# Altium schematic sheet LPCB220 - G210X MUX INTERFACE.SchDoc
size A3; Address1: Factory 10; Address2: 9-13 Dingley Avenue, Dandeong, VICTORIA 3175, AUSTRALIA; DocumentNumber: 8; Revision: 1; SheetNumber: 8; SheetTotal: 18; Lockie__PCB_SUB_ASSEMBLY: G210 Multiplexer Interface; Lockie__PCB_ASSEMBLY: Brake Control; Lockie__LDL: LPCB220; Lockie__PCB_DESCRIPTION: Redundant Stepper Node
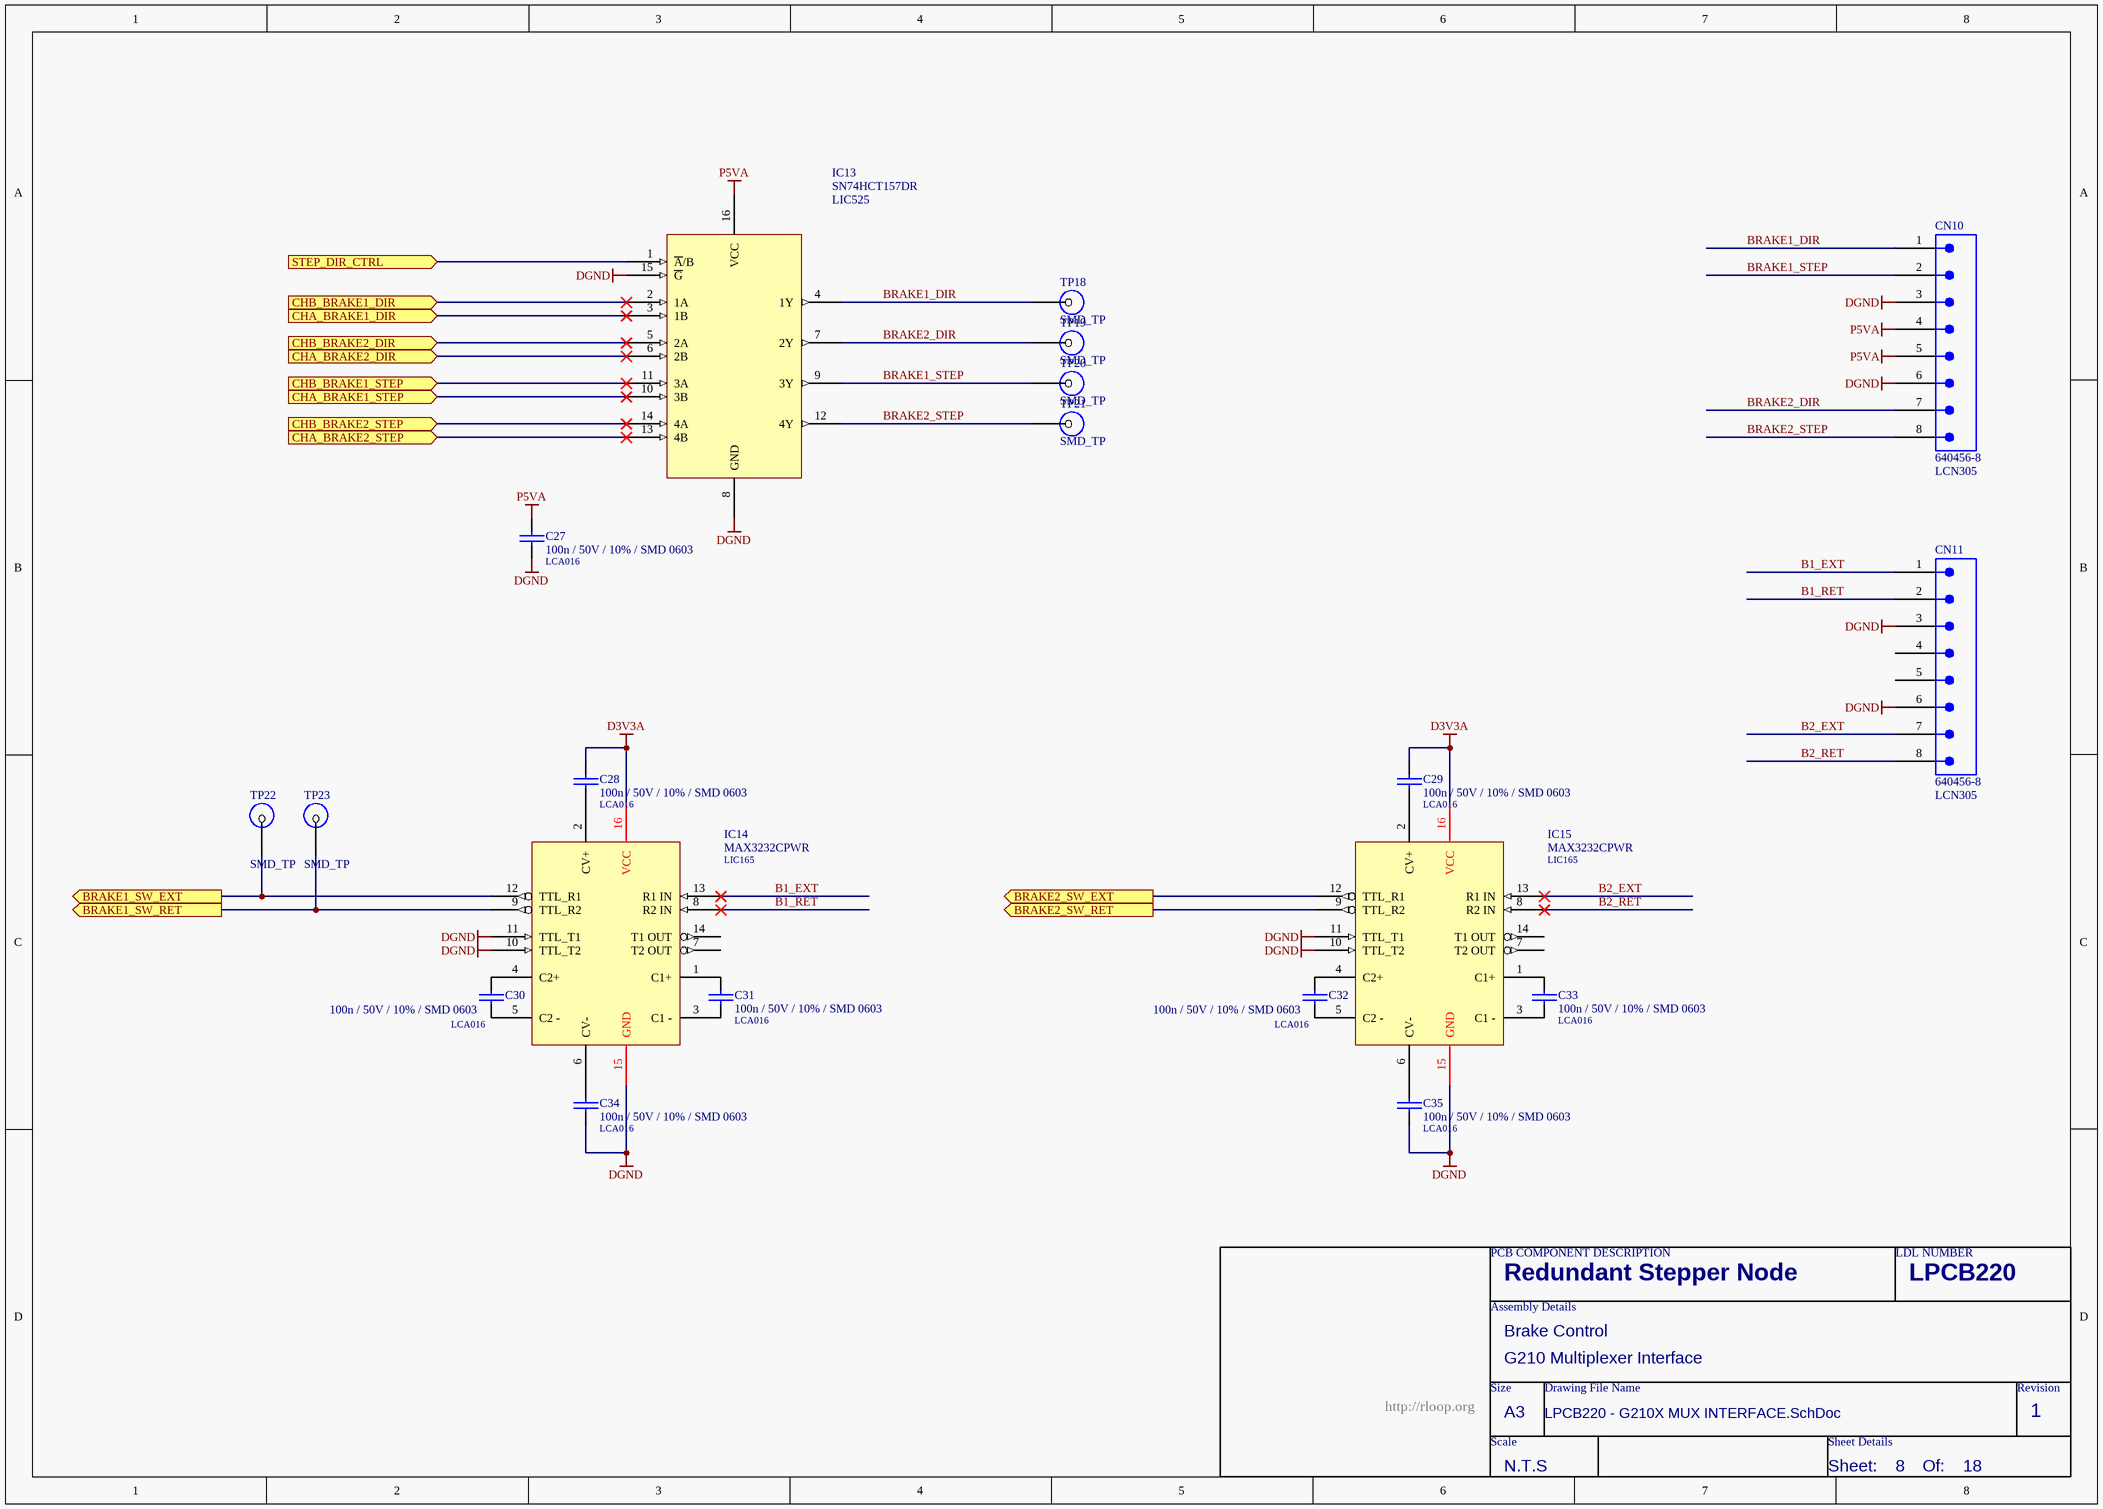
[diagram p0: LPCB220 - G210X MUX INTERFACE.SchDoc]

## Parts
C27  100n / 50V / 10% / SMD 0603  LDL_NUMBER: LCA016  [LFP011__CC1608-0603-IPC7351_B]
C28  100n / 50V / 10% / SMD 0603  LDL_NUMBER: LCA016  [LFP011__CC1608-0603-IPC7351_B]
C29  100n / 50V / 10% / SMD 0603  LDL_NUMBER: LCA016  [LFP011__CC1608-0603-IPC7351_B]
C30  100n / 50V / 10% / SMD 0603  LDL_NUMBER: LCA016  [LFP011__CC1608-0603-IPC7351_B]
C31  100n / 50V / 10% / SMD 0603  LDL_NUMBER: LCA016  [LFP011__CC1608-0603-IPC7351_B]
C32  100n / 50V / 10% / SMD 0603  LDL_NUMBER: LCA016  [LFP011__CC1608-0603-IPC7351_B]
C33  100n / 50V / 10% / SMD 0603  LDL_NUMBER: LCA016  [LFP011__CC1608-0603-IPC7351_B]
C34  100n / 50V / 10% / SMD 0603  LDL_NUMBER: LCA016  [LFP011__CC1608-0603-IPC7351_B]
C35  100n / 50V / 10% / SMD 0603  LDL_NUMBER: LCA016  [LFP011__CC1608-0603-IPC7351_B]
CN10  640456-8  LDL_NUMBER: LCN305  [640456-8]
CN11  640456-8  LDL_NUMBER: LCN305  [640456-8]
IC13  SN74HCT157DR  LDL_NUMBER: LIC525  [LFP079__SOP16]
IC14  MAX3232CPWR  LDL_NUMBER: LIC165  [LFP049__TSSOP-16]
IC15  MAX3232CPWR  LDL_NUMBER: LIC165  [LFP049__TSSOP-16]
TP18  SMD_TP  [SMD-TP]  (no BOM)
TP19  SMD_TP  [SMD-TP]  (no BOM)
TP20  SMD_TP  [SMD-TP]  (no BOM)
TP21  SMD_TP  [SMD-TP]  (no BOM)
TP22  SMD_TP  [SMD-TP]  (no BOM)
TP23  SMD_TP  [SMD-TP]  (no BOM)

## Ports
BRAKE1_SW_EXT (out), BRAKE1_SW_RET (out), BRAKE2_SW_EXT (out), BRAKE2_SW_RET (out), CHA_BRAKE1_DIR (in), CHA_BRAKE1_STEP (in), CHA_BRAKE2_DIR (in), CHA_BRAKE2_STEP (in), CHB_BRAKE1_DIR (in), CHB_BRAKE1_STEP (in), CHB_BRAKE2_DIR (in), CHB_BRAKE2_STEP (in), STEP_DIR_CTRL (in)

## Nets
D3V3A: C28.1 C29.1 IC14.16(VCC) IC15.16(VCC)
DGND: C27.2 C34.2 C35.2 CN10.3 CN10.6 CN11.3 CN11.6 IC13.8(GND) IC13.15(~{G}) IC14.10(TTL_T2) IC14.11(TTL_T1) IC14.15(GND) IC15.10(TTL_T2) IC15.11(TTL_T1) IC15.15(GND)
P5VA: C27.1 CN10.4 CN10.5 IC13.16(VCC)
B1_EXT: CN11.1 IC14.13(R1_IN)
B1_RET: CN11.2 IC14.8(R2_IN)
B2_EXT: CN11.7 IC15.13(R1_IN)
B2_RET: CN11.8 IC15.8(R2_IN)
BRAKE1_DIR: CN10.1 IC13.4(1Y) TP18.1
BRAKE1_STEP: CN10.2 IC13.9(3Y) TP20.1
BRAKE1_SW_EXT: IC14.12(TTL_R1) TP22.1 ; port BRAKE1_SW_EXT
BRAKE1_SW_RET: IC14.9(TTL_R2) TP23.1 ; port BRAKE1_SW_RET
BRAKE2_DIR: CN10.7 IC13.7(2Y) TP19.1
BRAKE2_STEP: CN10.8 IC13.12(4Y) TP21.1
BRAKE2_SW_EXT: IC15.12(TTL_R1) ; port BRAKE2_SW_EXT
BRAKE2_SW_RET: IC15.9(TTL_R2) ; port BRAKE2_SW_RET
CHA_BRAKE1_DIR: IC13.3(1B) ; port CHA_BRAKE1_DIR
CHA_BRAKE1_STEP: IC13.10(3B) ; port CHA_BRAKE1_STEP
CHA_BRAKE2_DIR: IC13.6(2B) ; port CHA_BRAKE2_DIR
CHA_BRAKE2_STEP: IC13.13(4B) ; port CHA_BRAKE2_STEP
CHB_BRAKE1_DIR: IC13.2(1A) ; port CHB_BRAKE1_DIR
CHB_BRAKE1_STEP: IC13.11(3A) ; port CHB_BRAKE1_STEP
CHB_BRAKE2_DIR: IC13.5(2A) ; port CHB_BRAKE2_DIR
CHB_BRAKE2_STEP: IC13.14(4A) ; port CHB_BRAKE2_STEP
STEP_DIR_CTRL: IC13.1(~{A}/B) ; port STEP_DIR_CTRL
NetC28_2: C28.2 IC14.2(CV+)
NetC29_2: C29.2 IC15.2(CV+)
NetC30_1: C30.1 IC14.4(C2+)
NetC30_2: C30.2 IC14.5(C2_-)
NetC31_1: C31.1 IC14.1(C1+)
NetC31_2: C31.2 IC14.3(C1_-)
NetC32_1: C32.1 IC15.4(C2+)
NetC32_2: C32.2 IC15.5(C2_-)
NetC33_1: C33.1 IC15.1(C1+)
NetC33_2: C33.2 IC15.3(C1_-)
NetC34_1: C34.1 IC14.6(CV-)
NetC35_1: C35.1 IC15.6(CV-)

Not connected (* = marked no-connect by the designer): CN11 4 5; IC14 7(T2_OUT) 14(T1_OUT); IC15 7(T2_OUT) 14(T1_OUT)

## Notes on the sheet
- PCB COMPONENT DESCRIPTION
- LDL NUMBER
- Assembly Details
- Size
- Drawing File Name
- Revision
- http://rloop.org
- Scale
- A3
- Sheet Details
- N.T.S
- Sheet:
- Of:

## Library data of the parts
C27 = 100n / 50V / 10% / SMD 0603: Capacitor, Ceramic Chip, 100nF (0.1uF), 50V, 5%, SMD 0603 [LCA016]; FMEDA__OPERATING__VOLTAGE_MIN: 0; FMEDA__OPERATING__VOLTAGE_MAX: 3.3; FMEDA__OPERATING__TEMP_MIN: -20; FMEDA__OPERATING__TEMP_TYP: 27; FMEDA__OPERATING__TEMP_MAX: 50; FMEDA__CHANNEL: COM; Value: 100n; FMEDA__FUNCTION_IN_SYSTEM: *; FMEDA__OPERATING__VOLTAGE_TYP: 3.3
C28-C35 = 100n / 50V / 10% / SMD 0603: Capacitor, Ceramic Chip, 100nF, 50V, 10%, SMD 0603; FMEDA__OPERATING__VOLTAGE_MIN: 0; FMEDA__OPERATING__VOLTAGE_MAX: 3.3; FMEDA__OPERATING__TEMP_MIN: -20; FMEDA__OPERATING__TEMP_TYP: 27; FMEDA__OPERATING__TEMP_MAX: 50; FMEDA__CHANNEL: COM; Value: 100n; FMEDA__FUNCTION_IN_SYSTEM: *; FMEDA__OPERATING__VOLTAGE_TYP: 3.3
CN10 CN11 = 640456-8: Connector, Male Header, 8 Way; FMEDA__CHANNEL: COM; FMEDA__OPERATING__CURRENT_MAX: 0; FMEDA__OPERATING__TEMP_MAX: 50; FMEDA__OPERATING__TEMP_MIN: -20; FMEDA__OPERATING__TEMP_TYP: 27; FMEDA__OPERATING__VOLTAGE_MAX: 16; FMEDA__OPERATING__VOLTAGE_TYP: 12; FMEDA__FUNCTION_IN_SYSTEM: *; FMEDA__OPERATING__CURRENT_MIN: 0; FMEDA__OPERATING__CURRENT_TYP: 0; FMEDA__OPERATING__VOLTAGE_MIN: 0
IC13 = SN74HCT157DR: IC, Multiplexer Select 2-1 [LIC525]; FMEDA__CHANNEL: COM; FMEDA__FUNCTION_IN_SYSTEM: *
IC14 IC15 = MAX3232CPWR: IC, RS232 Line Driver, 3.3V, SMD TSSOP16; FMEDA__OPERATING__TEMP_MAX: 50; FMEDA__OPERATING__TEMP_MIN: -20; FMEDA__OPERATING__TEMP_TYP: 27; FMEDA__CHANNEL: COM; FMEDA__OPERATING__VOLTAGE_MAX: 3.3; FMEDA__OPERATING__VOLTAGE_MIN: 0; FMEDA__FUNCTION_IN_SYSTEM: *; FMEDA__OPERATING__VOLTAGE_TYP: 3.3
TP18-TP23 = SMD_TP: SMD Test Point; FMEDA__CHANNEL: COM; FMEDA__OPERATING__CURRENT_MAX: 0; FMEDA__OPERATING__TEMP_MAX: 50; FMEDA__OPERATING__TEMP_MIN: -20; FMEDA__OPERATING__TEMP_TYP: 27; FMEDA__OPERATING__VOLTAGE_MAX: 16; FMEDA__OPERATING__VOLTAGE_TYP: 12; FMEDA__OPERATING__CURRENT_MIN: 0; FMEDA__OPERATING__CURRENT_TYP: 0; FMEDA__OPERATING__VOLTAGE_MIN: 0